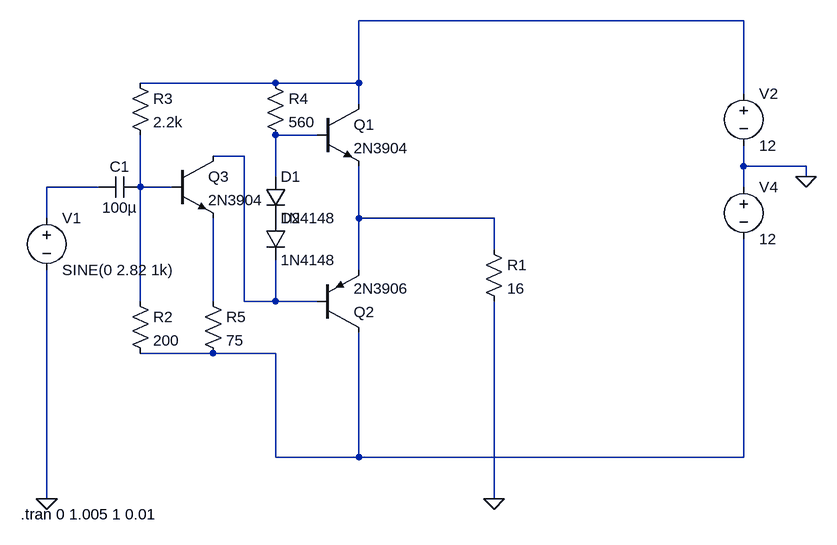
[diagram p0: schematic AMModulation2.asc]
AMModulation2.asc, the LTspice schematic file:
Version 4
SHEET 1 1284 680
WIRE 1168 -176 576 -176
WIRE 448 -80 240 -80
WIRE 576 -80 576 -176
WIRE 576 -80 448 -80
WIRE 1168 -64 1168 -176
WIRE 576 -48 576 -80
WIRE 512 0 448 0
WIRE 400 32 352 32
WIRE 1168 48 1168 16
WIRE 1264 48 1168 48
WIRE 448 64 448 0
WIRE 1264 64 1264 48
WIRE 176 80 96 80
WIRE 240 80 240 0
WIRE 288 80 240 80
WIRE 1168 80 1168 48
WIRE 96 128 96 80
WIRE 576 128 576 48
WIRE 784 128 576 128
WIRE 784 176 784 128
WIRE 576 208 576 128
WIRE 240 256 240 80
WIRE 352 256 352 128
WIRE 400 256 400 32
WIRE 448 256 448 192
WIRE 448 256 400 256
WIRE 512 256 448 256
WIRE 352 336 240 336
WIRE 448 336 352 336
WIRE 448 496 448 336
WIRE 576 496 576 304
WIRE 576 496 448 496
WIRE 1168 496 1168 160
WIRE 1168 496 576 496
WIRE 96 560 96 208
WIRE 784 560 784 256
FLAG 96 560 0
FLAG 784 560 0
FLAG 1264 64 0
SYMBOL voltage 96 112 R0
WINDOW 123 0 0 Left 0
WINDOW 39 0 0 Left 0
SYMATTR InstName V1
SYMATTR Value SINE(0 2.82 1k)
SYMBOL npn 512 -48 R0
SYMATTR InstName Q1
SYMATTR Value 2N3904
SYMBOL pnp 512 304 M180
SYMATTR InstName Q2
SYMATTR Value 2N3906
SYMBOL res 768 160 R0
SYMATTR InstName R1
SYMATTR Value 16
SYMBOL res 432 -96 R0
SYMATTR InstName R4
SYMATTR Value 560
SYMBOL voltage 1168 -80 R0
WINDOW 123 0 0 Left 0
WINDOW 39 0 0 Left 0
SYMATTR InstName V2
SYMATTR Value 12
SYMBOL voltage 1168 64 R0
WINDOW 123 0 0 Left 0
WINDOW 39 0 0 Left 0
SYMATTR InstName V4
SYMATTR Value 12
SYMBOL diode 432 64 R0
SYMATTR InstName D1
SYMATTR Value 1N4148
SYMBOL diode 432 128 R0
SYMATTR InstName D2
SYMATTR Value 1N4148
SYMBOL cap 240 64 R90
WINDOW 0 0 32 VBottom 2
WINDOW 3 32 32 VTop 2
SYMATTR InstName C1
SYMATTR Value 100µ
SYMBOL npn 288 32 R0
SYMATTR InstName Q3
SYMATTR Value 2N3904
SYMBOL res 224 240 R0
SYMATTR InstName R2
SYMATTR Value 200
SYMBOL res 224 -96 R0
SYMATTR InstName R3
SYMATTR Value 2.2k
SYMBOL res 336 240 R0
SYMATTR InstName R5
SYMATTR Value 75
TEXT 56 584 Left 2 !.tran 0 1.005 1 0.01

The netlist it stands for:
* AMModulation2.asc
V1 N004 0 SINE(0 2.82 1k)
Q1 N001 N002 N006 0 2N3904
Q2 N008 N003 N006 0 2N3906
R1 N006 0 16
R4 N001 N002 560
V2 N001 0 12
V4 0 N008 12
D1 N002 P001 1N4148
D2 P001 N003 1N4148
C1 N005 N004 100µ
Q3 N003 N005 N007 0 2N3904
R2 N005 N008 200
R3 N001 N005 2.2k
R5 N007 N008 75
.model D D
.lib standard.dio
.model NPN NPN
.model PNP PNP
.lib standard.bjt
.tran 0 1.005 1 0.01
.backanno
.end